# EAGLE design RN52_Breakout_07-27-16 (EAGLE 7.1.0)
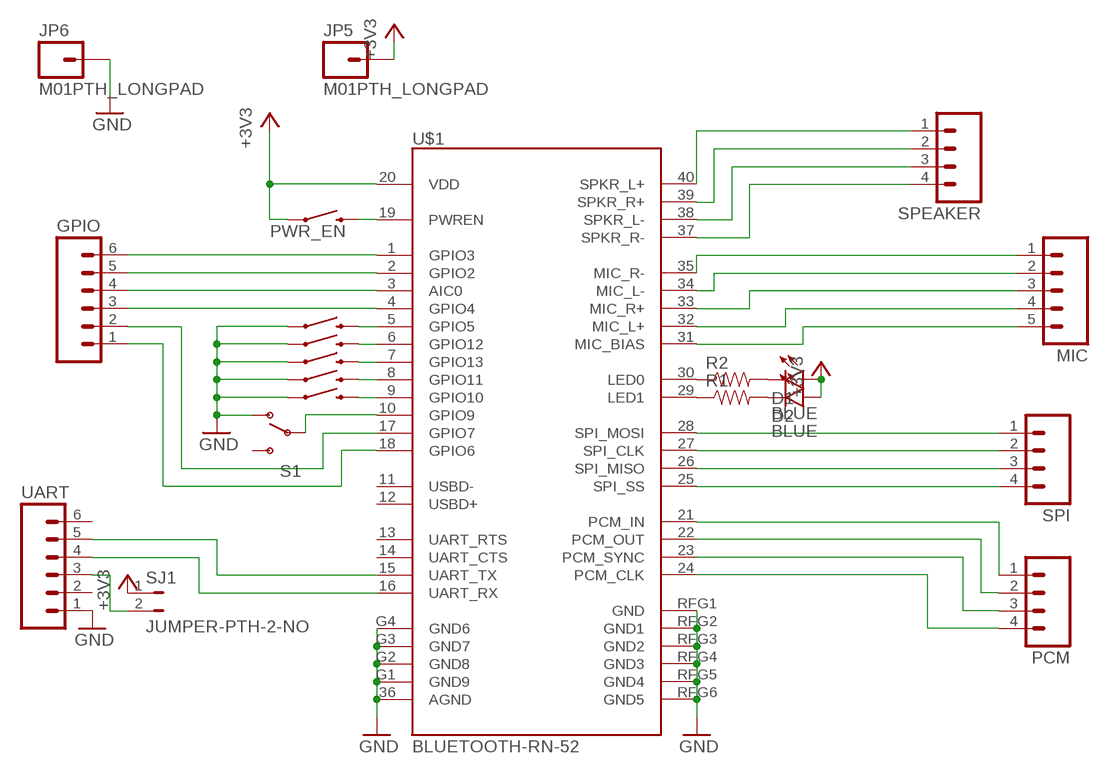
[diagram p0: schematic, sheet 1]

## Parts
D1  BLUE  LED-BLUE1206  [LED-1206]
D2  BLUE  LED-BLUE1206  [LED-1206]
GPIO  M06LONGPADS  [1X06_LONGPADS]
JP5  M01PTH_LONGPAD  [1X01_LONGPAD]
JP6  M01PTH_LONGPAD  [1X01_LONGPAD]
MIC  M05PTH_LONGPADS  [1X05_LONGPADS]
PCM  M04LONGPADS  [1X04_LONGPADS]
PWR_EN  SWITCH-MOMENTARY-2PTH  [TACTILE-PTH]
PWR_EN1  SWITCH-MOMENTARY-2PTH  [TACTILE-PTH]
PWR_EN2  SWITCH-MOMENTARY-2PTH  [TACTILE-PTH]
PWR_EN3  SWITCH-MOMENTARY-2PTH  [TACTILE-PTH]
PWR_EN4  SWITCH-MOMENTARY-2PTH  [TACTILE-PTH]
PWR_EN5  SWITCH-MOMENTARY-2PTH  [TACTILE-PTH]
R1  3.3MOHM-1/10W-1%(0603)  [0603-RES]
R2  3.3MOHM-1/10W-1%(0603)  [0603-RES]
S1  SWITCH-SPDTPTH  [SWITCH-SPDT]
SJ1  JUMPER-PTH-2-NO  [PTH-JUMPER-2-NO_NO_SILK]
SPEAKER  M04LONGPADS  [1X04_LONGPADS]
SPI  M04LONGPADS  [1X04_LONGPADS]
U$1  BLUETOOTH-RN-52  [RN-52]
UART  M06LONGPADS  [1X06_LONGPADS]

## Nets
+3V3: D1.A D2.A JP5.1 PWR_EN.1 SJ1.1 U$1.20(VDD)
GND: JP6.1 PWR_EN1.1 PWR_EN2.1 PWR_EN3.1 PWR_EN4.1 PWR_EN5.1 S1.1(O) U$1.36(AGND) U$1.G1(GND9) U$1.G2(GND8) U$1.G3(GND7) U$1.G4(GND6) U$1.RFG1(GND) U$1.RFG2(GND1) U$1.RFG3(GND2) U$1.RFG4(GND3) U$1.RFG5(GND4) U$1.RFG6(GND5) UART.1
N$1: PWR_EN1.3 U$1.5(GPIO5)
N$2: PWR_EN.3 U$1.19(PWREN)
N$3: PWR_EN2.3 U$1.6(GPIO12)
N$4: PWR_EN3.3 U$1.7(GPIO13)
N$5: PWR_EN4.3 U$1.8(GPIO11)
N$6: PWR_EN5.3 U$1.9(GPIO10)
N$7: S1.2(P) U$1.10(GPIO9)
N$8: R1.1 U$1.29(LED1)
N$9: R2.1 U$1.30(LED0)
N$10: D1.C R2.2
N$11: D2.C R1.2
N$13: SPEAKER.1 U$1.40(SPKR_L+)
N$14: SPEAKER.2 U$1.39(SPKR_R+)
N$15: SPEAKER.3 U$1.38(SPKR_L-)
N$16: SPEAKER.4 U$1.37(SPKR_R-)
N$17: MIC.1 U$1.35(MIC_R-)
N$18: MIC.2 U$1.34(MIC_L-)
N$19: MIC.3 U$1.33(MIC_R+)
N$20: MIC.4 U$1.32(MIC_L+)
N$21: MIC.5 U$1.31(MIC_BIAS)
N$22: SPI.1 U$1.28(SPI_MOSI)
N$23: SPI.2 U$1.27(SPI_CLK)
N$24: SPI.3 U$1.26(SPI_MISO)
N$25: SPI.4 U$1.25(SPI_SS)
N$26: SJ1.2 UART.3
N$27: U$1.16(UART_RX) UART.4
N$28: U$1.15(UART_TX) UART.5
N$29: PCM.1 U$1.21(PCM_IN)
N$30: PCM.2 U$1.22(PCM_OUT)
N$31: PCM.3 U$1.23(PCM_SYNC)
N$32: PCM.4 U$1.24(PCM_CLK)
N$33: GPIO.6 U$1.1(GPIO3)
N$34: GPIO.5 U$1.2(GPIO2)
N$35: GPIO.4 U$1.3(AIC0)
N$36: GPIO.3 U$1.4(GPIO4)
N$37: GPIO.2 U$1.17(GPIO7)
N$38: GPIO.1 U$1.18(GPIO6)
Unconnected: S1.3(S) U$1.11(USBD-) U$1.12(USBD+) U$1.13(UART_RTS) U$1.14(UART_CTS) UART.2 UART.6

## Library data of the parts
D1 D2 = SparkFun-LED:LED-BLUE: Blue LEDs for production use Various blue LEDs stocked by SparkFun production 0603 - DIO-08575 Rebel - DIO-09553 1206 - DIO-09911; PROD_ID: DIO-09911
GPIO UART = SparkFun-Connectors:M06: Header 6 Standard 6-pin 0.1" header. Use with straight break away headers (SKU : PRT-00116), right angle break away headers (PRT-00553), swiss pins (PRT-00743), machine pins (PRT-00117), and female headers (PRT-00115). Molex polarized connector foot print use with SKU : PRT-08094 with associated crimp pins and housings. NOTES ON THE VARIANTS LOCK and LOCK_LONGPADS... This footprint was designed to help hold the alignment of a through-hole component (i.e. 6-pin header) while soldering it into place. You may notice that each hole has been shifted either up or down by 0.005 of an inch from it's more standard position (which is a perfectly straight line). This slight alteration caused the pins (the squares in the middle) to touch the edges of the holes. Because they are alternating, it causes a "brace" to hold the component in place. 0.005 has proven to be the perfect amount of "off-center" position when using our standard breakaway headers. Although looks a little odd when you look at the bare footprint, once you have a header in there, the alteration is very hard to notice. Also,if you push a header all the way into place, it is covered up entirely on the bottom side. This idea of altering the position of holes to aid alignment will be further integrated into the Sparkfun Library for other footprints. It can help hold any component with 3 or more connection pins.
JP5 JP6 = SparkFun-Connectors:M01: Header 1 Standard 1-pin 0.1" header. Use with straight break away headers (SKU : PRT-00116), right angle break away headers (PRT-00553), swiss pins (PRT-00743), machine pins (PRT-00117), and female headers (PRT-00115).
MIC = SparkFun-Connectors:M05: Header 5 Standard 5-pin 0.1" header. Use with straight break away headers (SKU : PRT-00116), right angle break away headers (PRT-00553), swiss pins (PRT-00743), machine pins (PRT-00117), and female headers (PRT-00115). Molex polarized connector foot print use with SKU : PRT-08230 with associated crimp pins and housings.
PCM SPEAKER SPI = SparkFun-Connectors:M04: Header 4 Standard 4-pin 0.1" header. Use with straight break away headers (SKU : PRT-00116), right angle break away headers (PRT-00553), swiss pins (PRT-00743), machine pins (PRT-00117), and female headers (PRT-00115). Molex polarized connector foot print use with SKU : PRT-08231 with associated crimp pins and housings. 1MM SMD Version SKU: PRT-10208
PWR_EN PWR_EN1-PWR_EN5 = SparkFun-Electromechanical:SWITCH-MOMENTARY-2: Various NO switches- pushbuttons, reed, etc
R1 R2 = SparkFun-Resistors:3.3MOHM-1/10W-1%(0603): RES-11057; PROD_ID: RES-11057
S1 = SparkFun-Electromechanical:SWITCH-SPDT: SPDT Switch Simple slide switch, Spark Fun Electronics SKU : COM-00102 DPDT SMT slide switch, AYZ0202, SWCH-08179
SJ1 = SparkFun-Passives:JUMPER-PTH-2-NO
U$1 = SparkFun-RF:BLUETOOTH-RN-52

## Board
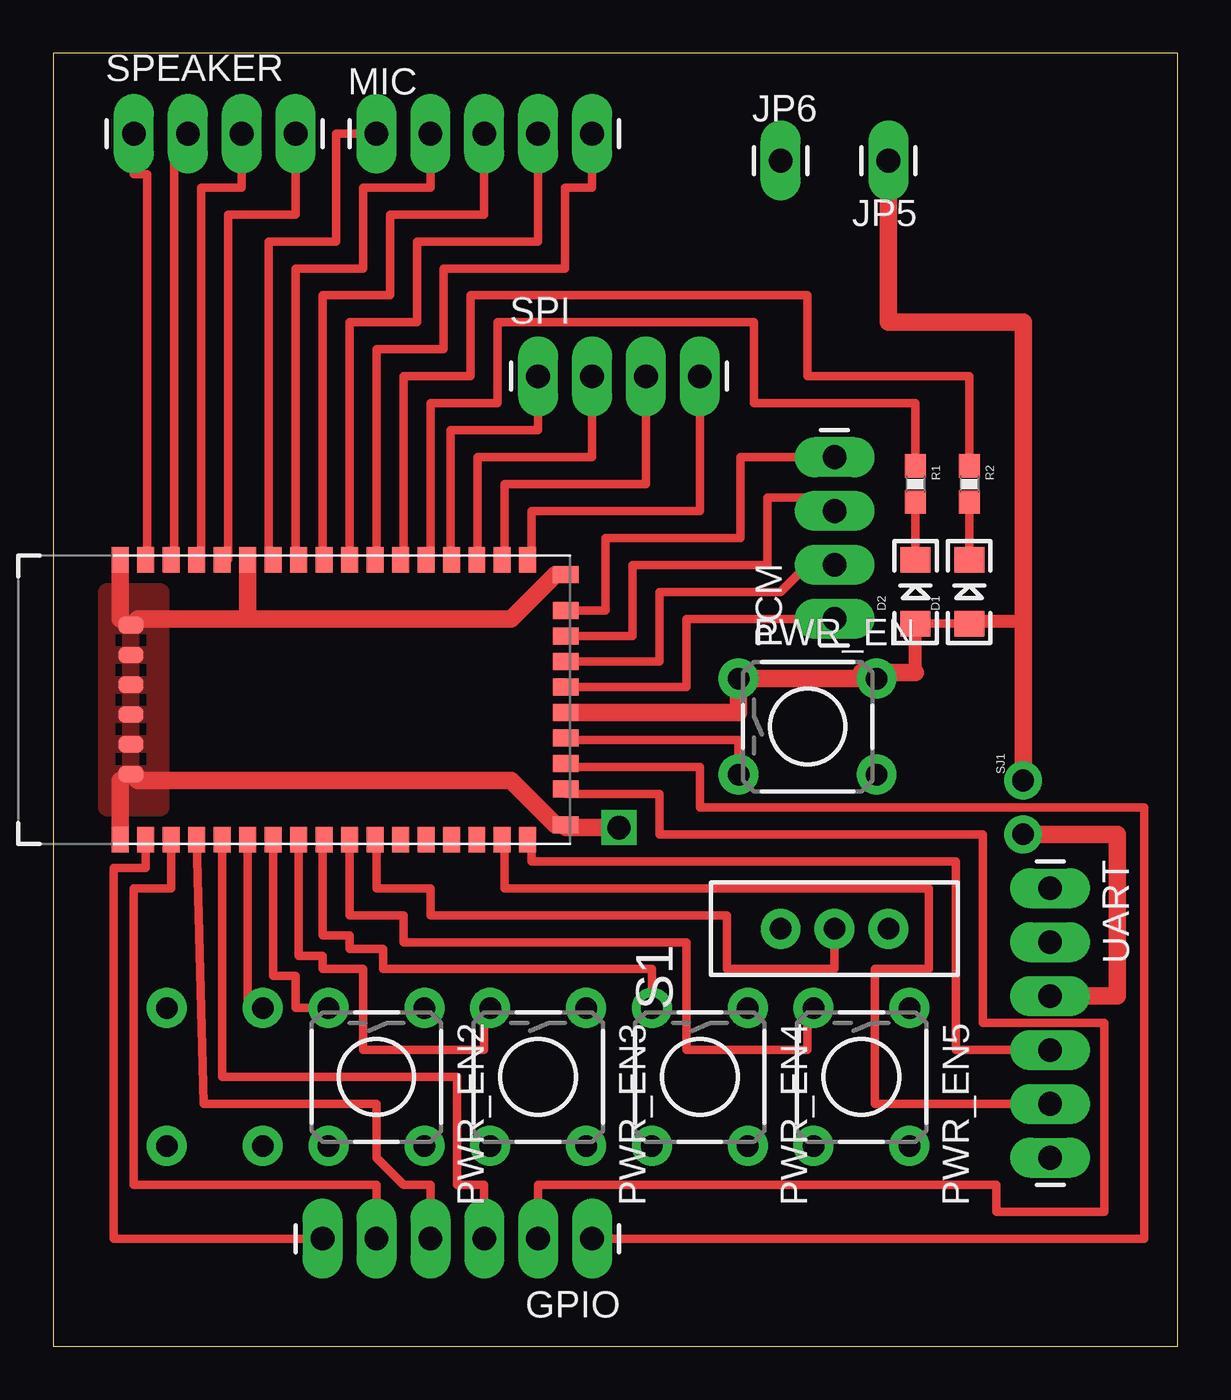
[diagram p1: board, top side]
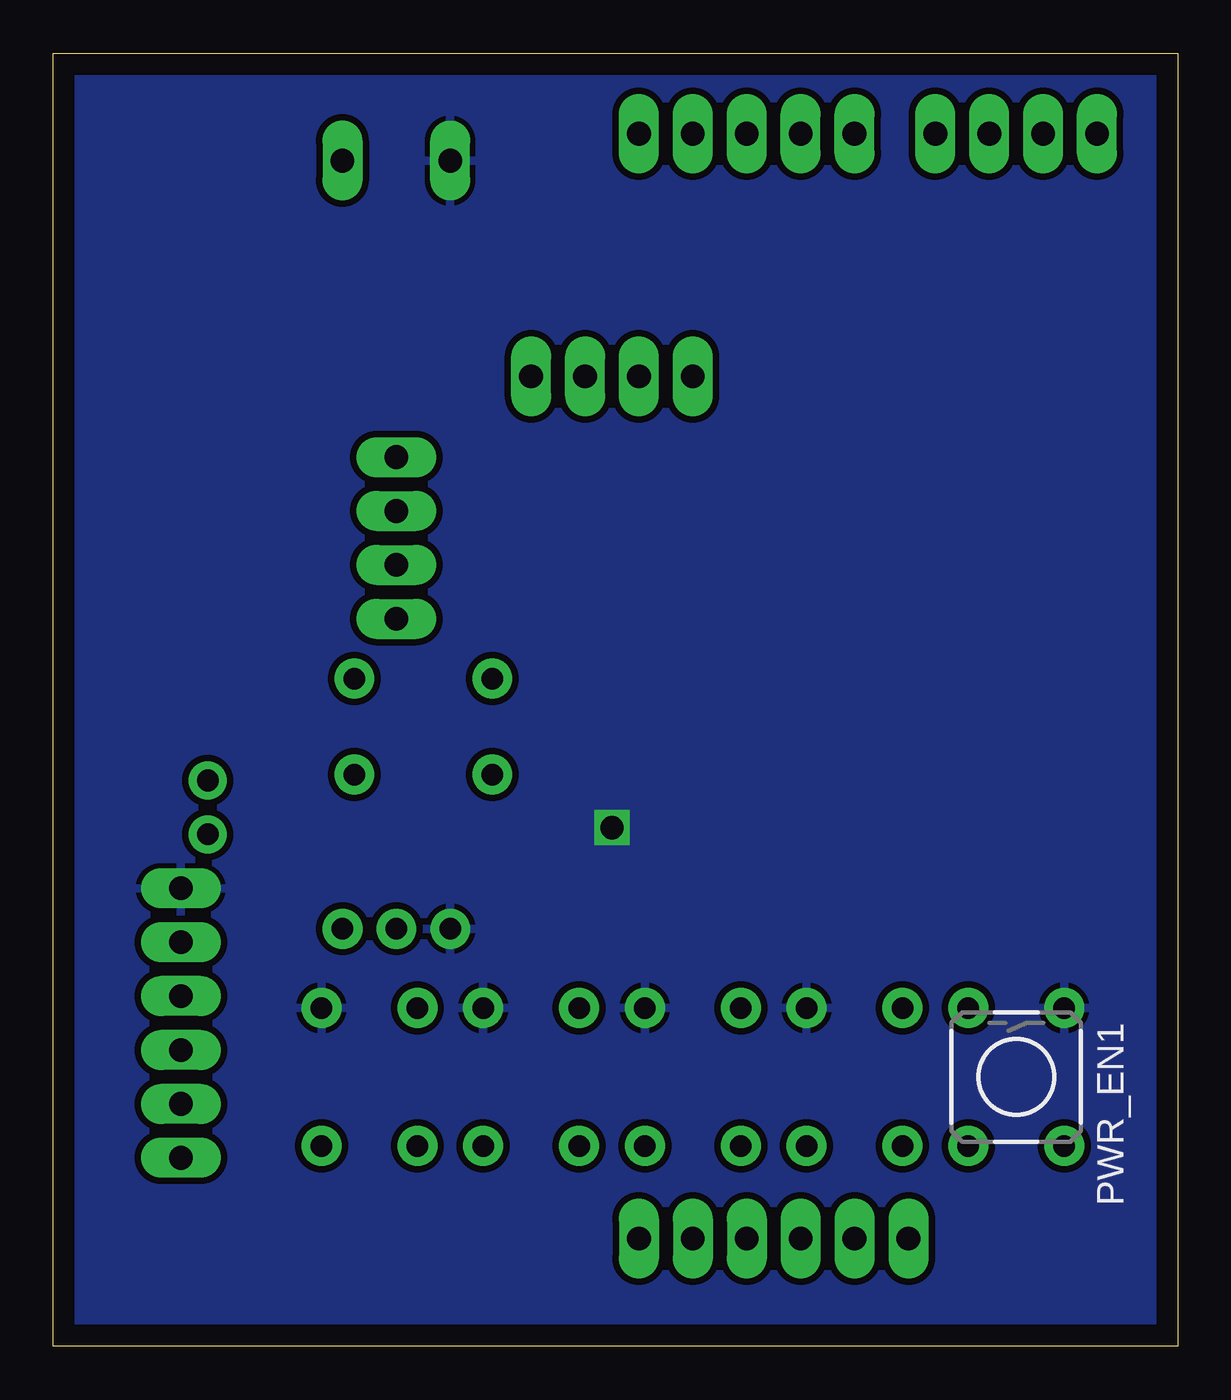
[diagram p2: board, bottom side, seen from below]

Size 53.01 x 60.95 mm. Coordinates in mm from the lower left corner, seen from the top.
Outline: 0,0 53.01,0 53.01,60.95 0,60.95 0,0
Copper layers (1*16): Top 0.035mm / dielectric 1.5mm / Bottom 0.035mm
Design rules "default *": minimum track width 10mil, minimum drill 24mil, track to track 12mil, track to pad 12mil, pad to pad 12mil, via to via 12mil, smd to smd 12mil, copper to edge 40mil, drill to drill 8mil, minimum pad ring 10mil, minimum via ring 8mil, stop-mask expansion 4mil, vias tented up to drill 0mil, thermal gap 10mil

### Footprints (pad centres in the part's own frame; a part is rotated, then mirrored left to right if it is on the bottom)
LED-1206 = smd 1.2 x 1.4: A -1.5,0; C 1.5,0
1X06_LONGPADS = drill 1.118 pad 1.88 long: 1 0,0; 2 2.54,0; 3 5.08,0; 4 7.62,0; 5 10.16,0; 6 12.7,0
1X01_LONGPAD = drill 1.118 pad 1.88 long: 1 0,0
1X05_LONGPADS = drill 1.118 pad 1.88 long: 1 0,0; 2 2.54,0; 3 5.08,0; 4 7.62,0; 5 10.16,0
1X04_LONGPADS = drill 1.118 pad 1.88 long: 1 0,0; 2 2.54,0; 3 5.08,0; 4 7.62,0
TACTILE-PTH = drill 1.016 pad 1.88: 1 -3.251,2.261; 2 3.251,2.261; 3 -3.251,-2.261; 4 3.251,-2.261
0603-RES = smd 1.1 x 1: 1 -0.85,0; 2 0.85,0
SWITCH-SPDT = drill 1.016 pad 1.88: 1 0,2.54; 2 0,0; 3 0,-2.54
PTH-JUMPER-2-NO_NO_SILK = drill 1.016 pad 1.778: 1 -1.27,0; 2 1.27,0
RN-52 = smd 1.2 x 0.8: 1 -6.6,8.33; 2 -6.6,7.13; 3 -6.6,5.93; 4 -6.6,4.73; 5 -6.6,3.53; 6 -6.6,2.33; 7 -6.6,1.13; 8 -6.6,-0.07; 9 -6.6,-1.27; 10 -6.6,-2.47; 11 -6.6,-3.67; 12 -6.6,-4.87; 13 -6.6,-6.07; 14 -6.6,-7.27; 15 -6.6,-8.47; 16 -6.6,-9.67; 25 6.6,-9.67; 26 6.6,-8.47; 27 6.6,-7.27; 28 6.6,-6.07; 29 6.6,-4.87; 30 6.6,-3.67; 31 6.6,-2.47; 32 6.6,-1.27; 33 6.6,-0.07; 34 6.6,1.13; 35 6.6,2.33; 36 6.6,3.53; 37 6.6,4.73; 38 6.6,5.93; 39 6.6,7.13; 40 6.6,8.33; G1 -6.6,9.53; G4 6.6,9.53 | smd 0.8 x 1.2: 17 -4.2,-11.47; 18 -3,-11.47; 19 -1.8,-11.47; 20 -0.6,-11.47; 21 0.6,-11.47; 22 1.8,-11.47; 23 3,-11.47; 24 4.2,-11.47; G2 -5.9,-11.47; G3 5.9,-11.46; RFG1 -3.5,9.03; RFG2 -2.1,9.03; RFG3 -0.7,9.03; RFG4 0.7,9.03; RFG5 2.1,9.03; RFG6 3.5,9.03

### Placement (x,y rotation side)
D1  43.18,35.56 90 top
D2  40.64,35.56 90 top
GPIO  25.4,5.08 180 top
JP5  39.37,55.88 180 top
JP6  34.29,55.88 0 top
MIC  15.24,57.15 0 top
PCM  36.83,34.29 90 top
PWR_EN  35.56,29.21 0 top
PWR_EN1  7.62,12.7 270 bottom
PWR_EN2  15.24,12.7 270 top
PWR_EN3  22.86,12.7 270 top
PWR_EN4  30.48,12.7 270 top
PWR_EN5  38.1,12.7 270 top
R1  40.64,40.64 270 top
R2  43.18,40.64 270 top
S1  36.83,19.68 90 top
SJ1  45.72,25.4 270 top
SPEAKER  3.81,57.15 0 top
SPI  22.86,45.72 0 top
U$1  12.7,30.48 90 top
UART  46.99,21.59 270 top

### Tracks (layer width: path | path; a pad name or v marks a point on that pad's centre or on a via)
+3V3
  Top 0.406: 38.1,31.47 38.1,31.75 | 45.72,34.29 43.18,34.29 D1.A D2.A 45.72,34.06
  Top 0.61: 40.64,31.75 D2.A
  Top 0.813: U$1.20 32.31,29.88 PWR_EN.1 38.1,31.47 | 38.1,31.75 40.64,31.75 | SJ1.1 45.72,34.29 | 45.72,34.06 45.72,48.26 39.37,48.26 JP5.1
GND  (via drill 1.1)
  Top 0.406: U$1.G3 23.68,36.38 | U$1.RFG6 3.98,34.29 3.17,34.29 | 23.68,24.58 U$1.G2 24.17,24.45 | U$1.RFG1 3.98,26.67 3.17,26.67 | 9.17,34.57 8.89,34.29
  Top 0.813: 23.68,36.38 21.59,34.29 8.89,34.29 3.98,34.29 | 23.68,24.58 21.59,26.67 3.98,26.67 | U$1.36 9.17,34.57 | 3.17,34.29 U$1.G4 | 3.17,26.67 U$1.G1 | v26.67,24.45 24.17,24.45
  pour Bottom: 0,60.96 53.34,60.96 54.61,0 0,0
  pour Top: 2.54,35.56 2.54,25.4 5.08,25.4 5.08,35.56
N$1
  Top 0.406: PWR_EN1.3 9.17,15.95 U$1.5
N$2
  Top 0.406: U$1.19 24.17,28.57 32.31,28.57 PWR_EN.3
N$3
  Top 0.406: PWR_EN2.3 11.43,15.95 11.43,17.46 10.37,17.46 U$1.6
N$4
  Top 0.406: PWR_EN3.3 20.32,15.95 20.32,13.97 14.61,13.97 14.61,17.78 12.7,17.78 12.7,18.41 11.57,18.41 U$1.7
N$5
  Top 0.406: U$1.8 12.7,23.88 12.7,19.37 13.97,19.37 13.97,18.73 15.56,18.73 15.56,17.78 28.22,17.78 PWR_EN4.3
N$6
  Top 0.406: PWR_EN5.3 35.56,15.95 35.56,13.97 29.84,13.97 29.84,19.05 16.51,19.05 16.51,20.32 13.97,20.32 U$1.9
N$7
  Top 0.406: U$1.10 15.24,23.88 15.24,21.59 17.78,21.59 17.78,20.32 31.75,20.32 31.75,17.78 36.83,17.78 S1.2
N$8
  Top 0.406: U$1.29 17.78,37.08 17.78,44.45 20.95,44.45 20.95,48.26 33.02,48.26 33.02,44.45 40.64,44.45 R1.1
N$9
  Top 0.406: U$1.30 16.51,37.08 16.51,45.72 19.68,45.72 19.68,49.53 35.56,49.53 35.56,45.72 43.18,45.72 R2.1
N$10
  Top 0.406: R2.2 D1.C
N$11
  Top 0.406: R1.2 D2.C
N$13
  Top 0.406: U$1.40 4.45,37.08 4.45,55.24 3.81,55.24 SPEAKER.1
N$14
  Top 0.406: U$1.39 5.71,37.08 5.71,55.88 SPEAKER.2
N$15
  Top 0.406: U$1.38 6.99,37.08 6.99,54.61 8.89,54.61 SPEAKER.3
N$16
  Top 0.406: U$1.37 8.26,37.08 8.26,53.34 11.43,53.34 SPEAKER.4
N$17
  Top 0.406: U$1.35 10.16,37.08 10.16,52.07 13.34,52.07 13.34,57.15 MIC.1
N$18
  Top 0.406: U$1.34 11.43,37.08 11.43,50.8 14.61,50.8 14.61,54.61 17.78,54.61 MIC.2
N$19
  Top 0.406: U$1.33 12.7,37.08 12.7,49.53 15.88,49.53 15.88,53.34 20.32,53.34 MIC.3
N$20
  Top 0.406: U$1.32 13.97,48.26 17.14,48.26 17.14,52.07 22.86,52.07 MIC.4
N$21
  Top 0.406: U$1.31 15.24,37.08 15.24,46.99 18.41,46.99 18.41,50.8 24.13,50.8 24.13,54.61 25.4,54.61 MIC.5
N$22
  Top 0.406: U$1.28 18.73,37.08 18.73,43.18 22.86,43.18 SPI.1
N$23
  Top 0.406: U$1.27 20,37.08 20,41.91 25.4,41.91 SPI.2
N$24
  Top 0.406: U$1.26 21.27,37.08 21.27,40.64 27.94,40.64 SPI.3
N$25
  Top 0.406: U$1.25 22.54,37.08 22.54,39.37 30.48,39.37 SPI.4
N$26
  Top 0.813: UART.3 50.16,16.51 50.16,24.13 SJ1.2
N$27
  Top 0.406: U$1.16 22.54,23.88 22.54,22.86 42.55,22.86 42.55,13.97 UART.4
N$28
  Top 0.406: U$1.15 21.27,23.88 21.27,21.59 41.27,21.59 41.27,17.78 38.73,17.78 38.73,11.43 UART.5
N$29
  Top 0.406: U$1.21 29.84,31.08 29.84,34.29 PCM.1
N$30
  Top 0.406: U$1.22 28.57,32.28 28.57,35.56 34.29,35.56 35.56,36.83 PCM.2
N$31
  Top 0.406: U$1.23 27.3,33.48 27.3,36.83 33.66,36.83 33.66,40.01 36.83,40.01 PCM.3
N$32
  Top 0.406: U$1.24 26.04,34.68 26.04,38.1 32.38,38.1 32.38,41.91 PCM.4
N$33
  Top 0.406: GPIO.6 2.86,5.08 2.86,22.54 4.37,22.54 U$1.1
N$34
  Top 0.406: GPIO.5 15.24,7.62 3.81,7.62 3.81,21.59 5.57,21.59 U$1.2
N$35
  Top 0.406: GPIO.4 17.78,7.62 16.51,7.62 15.24,8.89 15.24,11.43 7.09,11.43 U$1.3
N$36
  Top 0.406: GPIO.3 20.32,7.62 19.05,7.62 19.05,12.7 7.97,12.7 U$1.4
N$37
  Top 0.406: GPIO.2 22.86,7.62 44.45,7.62 44.45,6.35 49.53,6.35 49.53,15.24 43.81,15.24 43.81,24.13 28.57,24.13 28.57,26.04 24.17,26.04 U$1.17
N$38
  Top 0.406: GPIO.1 51.44,5.08 51.44,25.4 30.48,25.4 30.48,27.3 24.17,27.3 U$1.18